# Altium schematic sheet LPCB234 - OVERVIEW.SchDoc
size A3; Address1: Factory 10; Address2: 9-13 Dingley Avenue, Dandeong, VICTORIA 3175, AUSTRALIA; DocumentNumber: 1; Revision: 1; SheetNumber: 1; SheetTotal: 10; Lockie__PCB_SUB_ASSEMBLY: Overview; Lockie__PCB_ASSEMBLY: Main; Lockie__LDL: LPCB234; Lockie__PCB_DESCRIPTION: RM4 Power Node
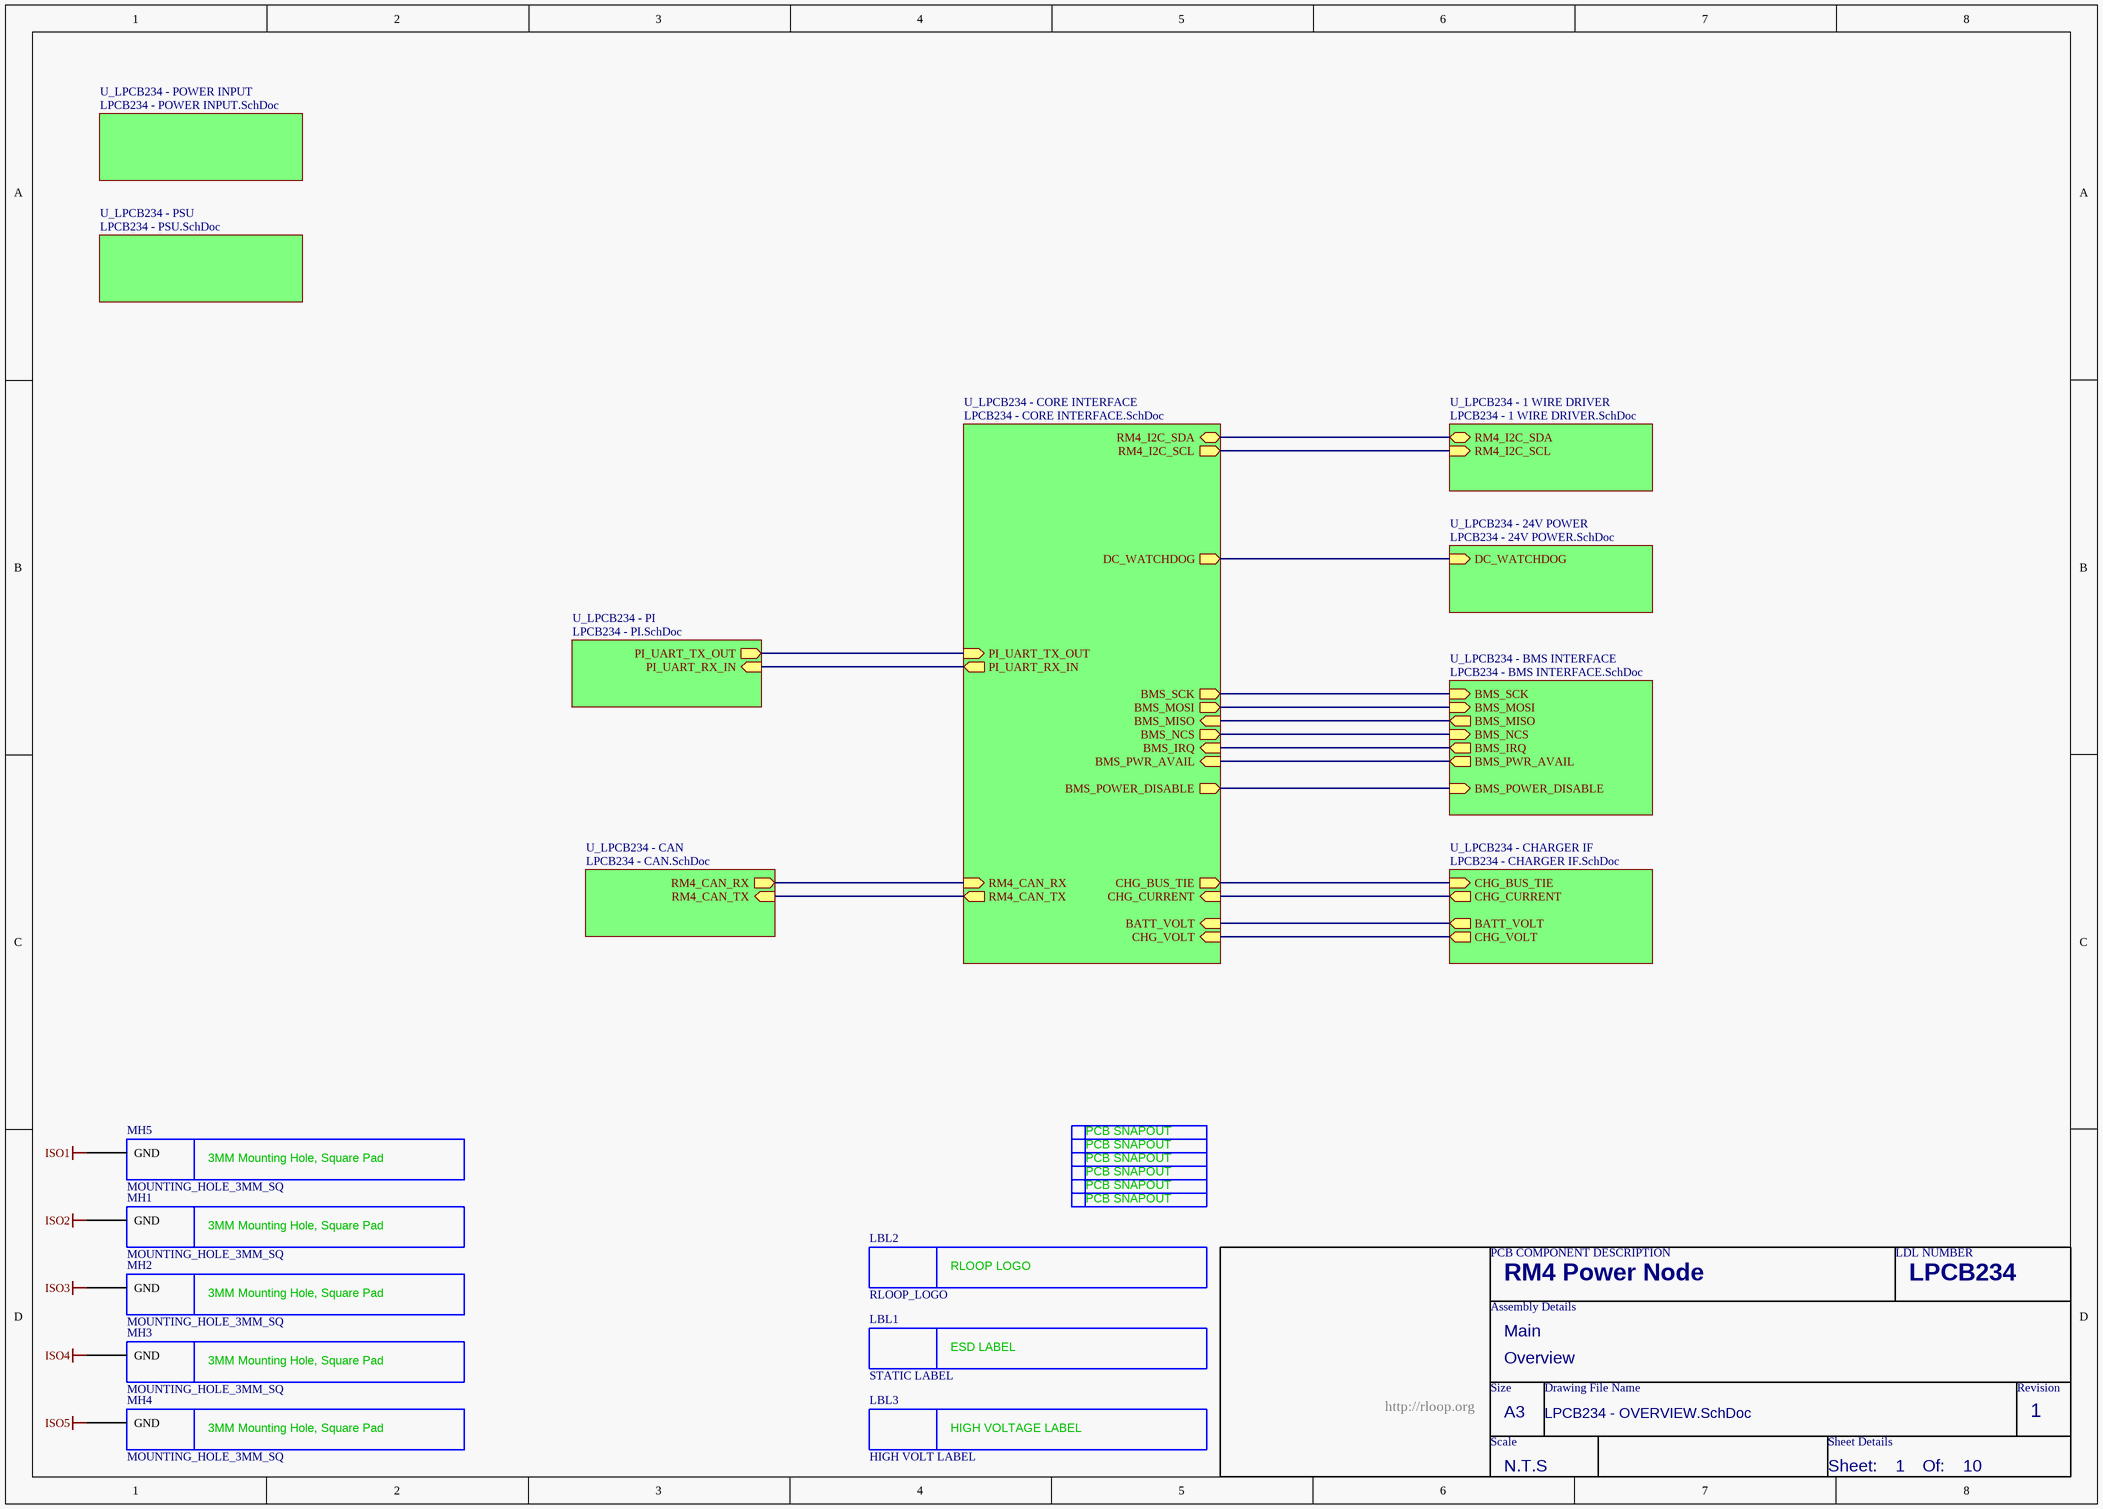
[diagram p0: LPCB234 - OVERVIEW.SchDoc]

## Parts
LBL1  STATIC LABEL  [STATIC_LABEL]  (no BOM)
LBL2  RLOOP_LOGO  [RLOOP_LOGO]  (no BOM)
LBL3  HIGH VOLT LABEL  [HIGH VOLT LABEL]  (no BOM)
MH1  MOUNTING_HOLE_3MM_SQ  [MOUNTING_HOLE_3MM_SQ]  (no BOM)
MH2  MOUNTING_HOLE_3MM_SQ  [MOUNTING_HOLE_3MM_SQ]  (no BOM)
MH3  MOUNTING_HOLE_3MM_SQ  [MOUNTING_HOLE_3MM_SQ]  (no BOM)
MH4  MOUNTING_HOLE_3MM_SQ  [MOUNTING_HOLE_3MM_SQ]  (no BOM)
MH5  MOUNTING_HOLE_3MM_SQ  [MOUNTING_HOLE_3MM_SQ]  (no BOM)
SN1  PCB_SNAPOUT  [SNAPOUT_NEW]  (value not drawn)  (no BOM)
SN2  PCB_SNAPOUT  [SNAPOUT_NEW]  (value not drawn)  (no BOM)
SN3  PCB_SNAPOUT  [SNAPOUT_NEW]  (value not drawn)  (no BOM)
SN4  PCB_SNAPOUT  [SNAPOUT_NEW]  (value not drawn)  (no BOM)
SN5  PCB_SNAPOUT  [SNAPOUT_NEW]  (value not drawn)  (no BOM)
SN6  PCB_SNAPOUT  [SNAPOUT_NEW]  (value not drawn)  (no BOM)

## Sub-sheets
U_LPCB234 - 1 WIRE DRIVER = LPCB234 - 1 WIRE DRIVER.SchDoc: RM4_I2C_SDA (bidir), RM4_I2C_SCL (in)
U_LPCB234 - 24V POWER = LPCB234 - 24V POWER.SchDoc: DC_WATCHDOG (in)
U_LPCB234 - BMS INTERFACE = LPCB234 - BMS INTERFACE.SchDoc: BMS_MOSI (in), BMS_SCK (in), BMS_MISO (out), BMS_PWR_AVAIL (out), BMS_NCS (in), BMS_IRQ (out), BMS_POWER_DISABLE (in)
U_LPCB234 - CAN = LPCB234 - CAN.SchDoc: RM4_CAN_TX (in), RM4_CAN_RX (out)
U_LPCB234 - CHARGER IF = LPCB234 - CHARGER IF.SchDoc: CHG_BUS_TIE (in), CHG_CURRENT (out), BATT_VOLT (out), CHG_VOLT (out)
U_LPCB234 - CORE INTERFACE = LPCB234 - CORE INTERFACE.SchDoc: BMS_MOSI (out), BMS_SCK (out), BMS_MISO (in), BMS_PWR_AVAIL (in), BMS_NCS (out), BMS_IRQ (in), DC_WATCHDOG (out), CHG_CURRENT (in), RM4_I2C_SDA (bidir), RM4_I2C_SCL (out), BMS_POWER_DISABLE (out), CHG_BUS_TIE (out), RM4_CAN_TX (out), RM4_CAN_RX (in), PI_UART_TX_OUT (in), PI_UART_RX_IN (out), BATT_VOLT (in), CHG_VOLT (in)
U_LPCB234 - PI = LPCB234 - PI.SchDoc: PI_UART_RX_IN (in), PI_UART_TX_OUT (out)
U_LPCB234 - POWER INPUT = LPCB234 - POWER INPUT.SchDoc: no entries
U_LPCB234 - PSU = LPCB234 - PSU.SchDoc: no entries

## Nets
ISO1: MH5.MOUNT(GND)
ISO2: MH1.MOUNT(GND)
ISO3: MH2.MOUNT(GND)
ISO4: MH3.MOUNT(GND)
ISO5: MH4.MOUNT(GND)
(unnamed): sheet U_LPCB234 - CORE INTERFACE/BMS_MOSI, sheet U_LPCB234 - BMS INTERFACE/BMS_MOSI
(unnamed): sheet U_LPCB234 - CORE INTERFACE/BMS_SCK, sheet U_LPCB234 - BMS INTERFACE/BMS_SCK
(unnamed): sheet U_LPCB234 - CORE INTERFACE/BMS_MISO, sheet U_LPCB234 - BMS INTERFACE/BMS_MISO
(unnamed): sheet U_LPCB234 - CORE INTERFACE/BMS_PWR_AVAIL, sheet U_LPCB234 - BMS INTERFACE/BMS_PWR_AVAIL
(unnamed): sheet U_LPCB234 - CORE INTERFACE/BMS_NCS, sheet U_LPCB234 - BMS INTERFACE/BMS_NCS
(unnamed): sheet U_LPCB234 - CORE INTERFACE/BMS_IRQ, sheet U_LPCB234 - BMS INTERFACE/BMS_IRQ
(unnamed): sheet U_LPCB234 - CORE INTERFACE/DC_WATCHDOG, sheet U_LPCB234 - 24V POWER/DC_WATCHDOG
(unnamed): sheet U_LPCB234 - CORE INTERFACE/CHG_CURRENT, sheet U_LPCB234 - CHARGER IF/CHG_CURRENT
(unnamed): sheet U_LPCB234 - CORE INTERFACE/RM4_I2C_SDA, sheet U_LPCB234 - 1 WIRE DRIVER/RM4_I2C_SDA
(unnamed): sheet U_LPCB234 - CORE INTERFACE/RM4_I2C_SCL, sheet U_LPCB234 - 1 WIRE DRIVER/RM4_I2C_SCL
(unnamed): sheet U_LPCB234 - CORE INTERFACE/BMS_POWER_DISABLE, sheet U_LPCB234 - BMS INTERFACE/BMS_POWER_DISABLE
(unnamed): sheet U_LPCB234 - CORE INTERFACE/CHG_BUS_TIE, sheet U_LPCB234 - CHARGER IF/CHG_BUS_TIE
(unnamed): sheet U_LPCB234 - CORE INTERFACE/RM4_CAN_TX, sheet U_LPCB234 - CAN/RM4_CAN_TX
(unnamed): sheet U_LPCB234 - CORE INTERFACE/RM4_CAN_RX, sheet U_LPCB234 - CAN/RM4_CAN_RX
(unnamed): sheet U_LPCB234 - CORE INTERFACE/PI_UART_TX_OUT, sheet U_LPCB234 - PI/PI_UART_TX_OUT
(unnamed): sheet U_LPCB234 - CORE INTERFACE/PI_UART_RX_IN, sheet U_LPCB234 - PI/PI_UART_RX_IN
(unnamed): sheet U_LPCB234 - CORE INTERFACE/BATT_VOLT, sheet U_LPCB234 - CHARGER IF/BATT_VOLT
(unnamed): sheet U_LPCB234 - CORE INTERFACE/CHG_VOLT, sheet U_LPCB234 - CHARGER IF/CHG_VOLT

## Notes on the sheet
- PCB COMPONENT DESCRIPTION
- LDL NUMBER
- Assembly Details
- Size
- Drawing File Name
- Revision
- http://rloop.org
- Scale
- A3
- Sheet Details
- N.T.S
- Sheet:
- Of:
- (in symbol HIGH VOLT LABEL) HIGH VOLTAGE LABEL
- (in symbol MOUNTING_HOLE_3MM_SQ) 3MM Mounting Hole, Square Pad
- (in symbol PCB_SNAPOUT) PCB SNAPOUT
- (in symbol RLOOP_LOGO) RLOOP LOGO
- (in symbol STATIC LABEL) ESD LABEL

## Library data of the parts
LBL1 = STATIC LABEL: FMEDA__CHANNEL: DIAG; FMEDA__FUNCTION_IN_SYSTEM: *
LBL2 = RLOOP_LOGO: FMEDA__CHANNEL: DIAG; FMEDA__FUNCTION_IN_SYSTEM: *
LBL3 = HIGH VOLT LABEL: FMEDA__CHANNEL: DIAG; FMEDA__FUNCTION_IN_SYSTEM: *
MH1-MH5 = MOUNTING_HOLE_3MM_SQ: 3MM Mouting Hole, Square; FMEDA__CHANNEL: DIAG; FMEDA__FUNCTION_IN_SYSTEM: *
SN1-SN6 = PCB_SNAPOUT: FMEDA__CHANNEL: DIAG; FMEDA__FUNCTION_IN_SYSTEM: *